# Altium schematic sheet XTXBoard(2CPU).SchDoc
size C; DocumentNumber: 6; SheetNumber: 6; SheetTotal: 8
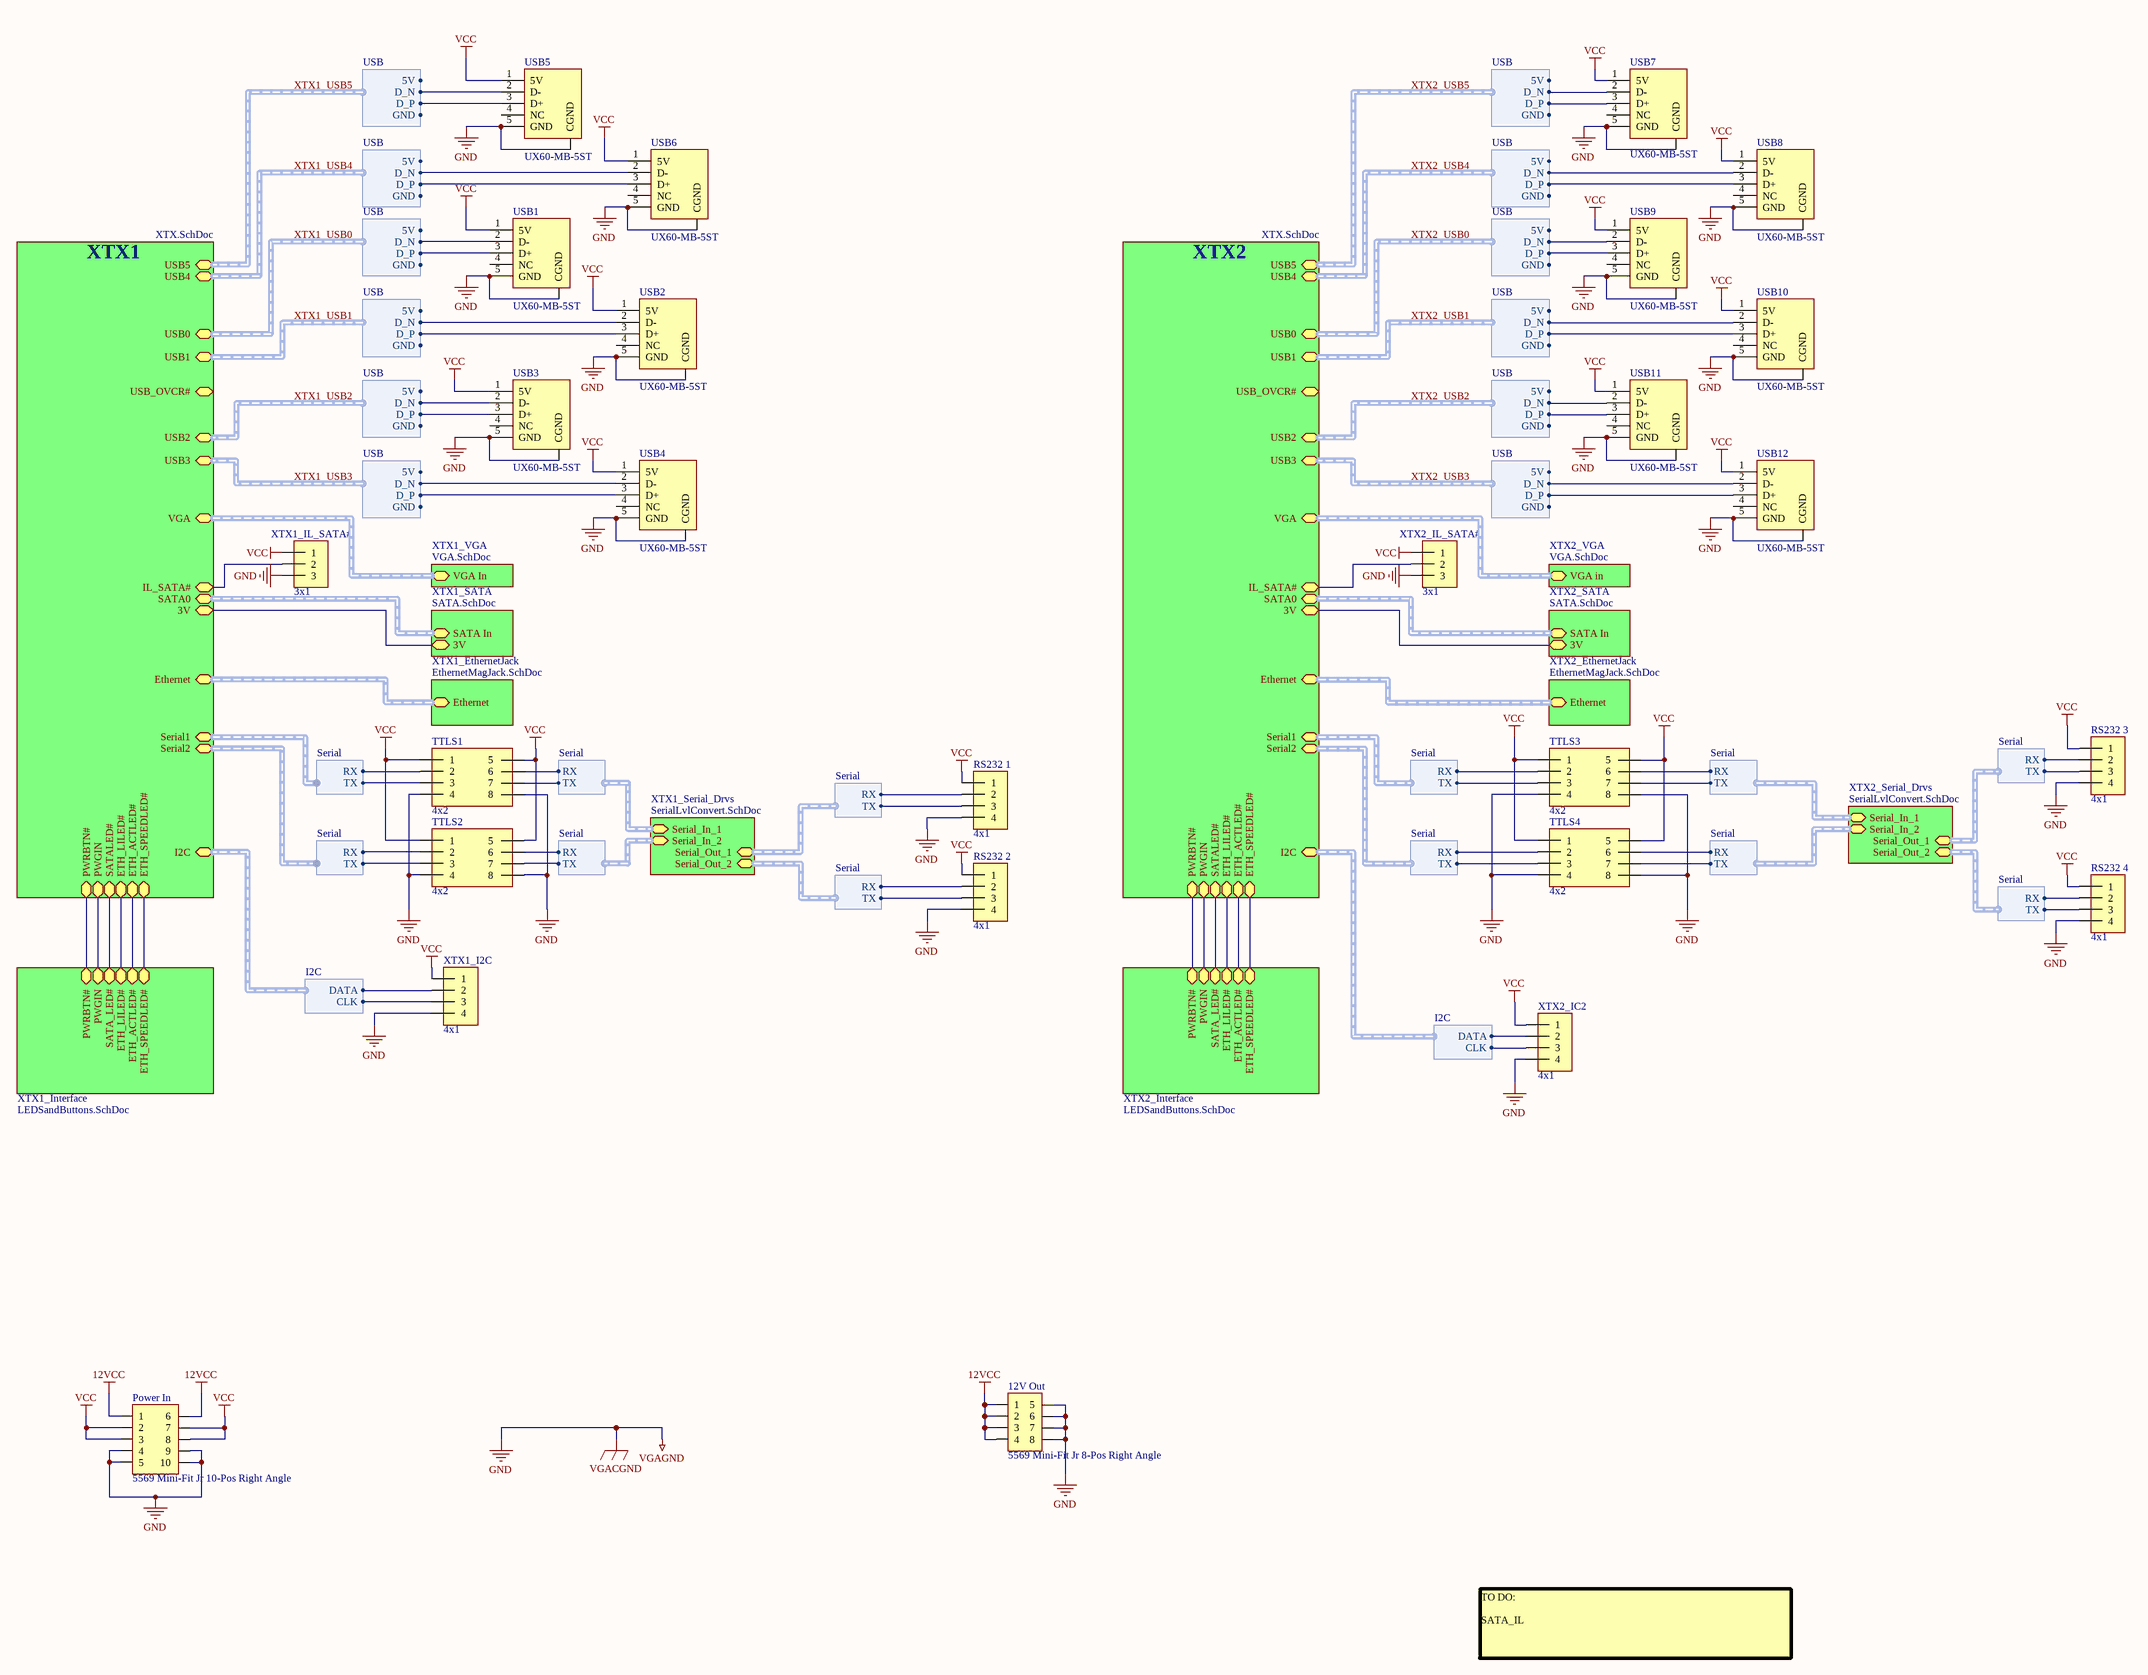
[diagram p0: XTXBoard(2CPU).SchDoc]

## Parts
12V_Out  5569 Mini-Fit Jr 8-Pos Right Angle  [8-POS 5569 Mini-Fit Jr 2]
Power_In  5569 Mini-Fit Jr 10-Pos Right Angle  [10-Pos 5569 Mini-Fit Jr 2]
RS232_1  4x1  [Male 4x1]
RS232_2  4x1  [Male 4x1]
RS232_3  4x1  [Male 4x1]
RS232_4  4x1  [Male 4x1]
TTLS1  4x2  [Male 4x2]
TTLS2  4x2  [Male 4x2]
TTLS3  4x2  [FEMALE 4x2]
TTLS4  4x2  [FEMALE 4x2]
USB1  UX60-MB-5ST  [UX60-MB-5ST]
USB2  UX60-MB-5ST  [UX60-MB-5ST]
USB3  UX60-MB-5ST  [UX60-MB-5ST]
USB4  UX60-MB-5ST  [UX60-MB-5ST]
USB5  UX60-MB-5ST  [UX60-MB-5ST]
USB6  UX60-MB-5ST  [UX60-MB-5ST]
USB7  UX60-MB-5ST  [UX60-MB-5ST]
USB8  UX60-MB-5ST  [UX60-MB-5ST]
USB9  UX60-MB-5ST  [UX60-MB-5ST]
USB10  UX60-MB-5ST  [UX60-MB-5ST]
USB11  UX60-MB-5ST  [UX60-MB-5ST]
USB12  UX60-MB-5ST  [UX60-MB-5ST]
XTX1_I2C  4x1  [Male 4x1]
XTX1_IL_SATA#  3x1  [Male 3x1]
XTX2_IC2  4x1  [Male 4x1]
XTX2_IL_SATA#  3x1  [Male 3x1]

## Sub-sheets
XTX1 = XTX.SchDoc: ETH_LILED#, ETH_ACTLED#, ETH_SPEEDLED#, Ethernet (harness Ethernet), SATA0 (harness SATA), VGA (harness VGA), USB0 (harness USB), USB2 (harness USB), USB3 (harness USB), USB1 (harness USB), USB_OVCR#, SATALED#, I2C (harness I2C), Serial1 (harness Serial), Serial2 (harness Serial), PWRBTN#, PWGIN, 3V, IL_SATA#, USB5 (harness USB), USB4 (harness USB)
XTX1_EthernetJack = EthernetMagJack.SchDoc: Ethernet (harness Ethernet)
XTX1_Interface = LEDSandButtons.SchDoc: ETH_LILED#, ETH_ACTLED#, SATA_LED#, PWRBTN#, ETH_SPEEDLED#, PWGIN
XTX1_SATA = SATA.SchDoc: SATA In (harness SATA), 3V
XTX1_Serial_Drvs = SerialLvlConvert.SchDoc: Serial_In_2 (harness Serial), Serial_In_1 (harness Serial), Serial_Out_2 (harness Serial), Serial_Out_1 (harness Serial)
XTX1_VGA = VGA.SchDoc: VGA In (harness VGA)
XTX2 = XTX.SchDoc: USB5 (harness USB), USB4 (harness USB), USB0 (harness USB), USB1 (harness USB), USB_OVCR#, USB2 (harness USB), USB3 (harness USB), VGA (harness VGA), IL_SATA#, SATA0 (harness SATA), 3V, Ethernet (harness Ethernet), Serial1 (harness Serial), Serial2 (harness Serial), I2C (harness I2C), PWRBTN#, PWGIN, ETH_LILED#, SATALED#, ETH_ACTLED#, ETH_SPEEDLED#
XTX2_EthernetJack = EthernetMagJack.SchDoc: Ethernet (harness Ethernet)
XTX2_Interface = LEDSandButtons.SchDoc: PWRBTN#, PWGIN, SATA_LED#, ETH_LILED#, ETH_ACTLED#, ETH_SPEEDLED#
XTX2_SATA = SATA.SchDoc: SATA In (harness SATA), 3V
XTX2_Serial_Drvs = SerialLvlConvert.SchDoc: Serial_In_1 (harness Serial), Serial_In_2 (harness Serial), Serial_Out_1 (harness Serial), Serial_Out_2 (harness Serial)
XTX2_VGA = VGA.SchDoc: VGA in (harness VGA)

## Harnesses
USB: 5V, D_N, D_P, GND
I2C: CLK, DATA
Serial: RX, TX

## Nets
12VCC: 12V_Out.1 12V_Out.2 12V_Out.3 12V_Out.4 Power_In.1 Power_In.6
GND: 12V_Out.5 12V_Out.6 12V_Out.7 12V_Out.8 Power_In.4 Power_In.5 Power_In.9 Power_In.10 RS232_1.4 RS232_2.4 RS232_3.4 RS232_4.4 TTLS1.4 TTLS1.8 TTLS2.4 TTLS2.8 TTLS3.4 TTLS3.8 TTLS4.4 TTLS4.8 USB1.5(GND) USB1.CGND USB2.5(GND) USB2.CGND USB3.5(GND) USB3.CGND USB4.5(GND) USB4.CGND USB5.5(GND) USB5.CGND USB6.5(GND) USB6.CGND USB7.5(GND) USB7.CGND USB8.5(GND) USB8.CGND USB9.5(GND) USB9.CGND USB10.5(GND) USB10.CGND USB11.5(GND) USB11.CGND USB12.5(GND) USB12.CGND XTX1_I2C.4 XTX1_IL_SATA#.3 XTX2_IC2.4 XTX2_IL_SATA#.3  [also labelled VGACGND, VGAGND]
VCC: Power_In.2 Power_In.3 Power_In.7 Power_In.8 RS232_1.1 RS232_2.1 RS232_3.1 RS232_4.1 TTLS1.1 TTLS1.5 TTLS2.1 TTLS2.5 TTLS3.1 TTLS3.5 TTLS4.1 TTLS4.5 USB1.1(5V) USB2.1(5V) USB3.1(5V) USB4.1(5V) USB5.1(5V) USB6.1(5V) USB7.1(5V) USB8.1(5V) USB9.1(5V) USB10.1(5V) USB11.1(5V) USB12.1(5V) XTX1_I2C.1 XTX1_IL_SATA#.1 XTX2_IC2.1 XTX2_IL_SATA#.1
XTX1_USB0.D_N: USB1.2(D-) ; sheet XTX1/USB0.D_N
XTX1_USB0.D_P: USB1.3(D+) ; sheet XTX1/USB0.D_P
XTX1_USB1.D_N: USB2.2(D-) ; sheet XTX1/USB1.D_N
XTX1_USB1.D_P: USB2.3(D+) ; sheet XTX1/USB1.D_P
XTX1_USB2.D_N: USB3.2(D-) ; sheet XTX1/USB2.D_N
XTX1_USB2.D_P: USB3.3(D+) ; sheet XTX1/USB2.D_P
XTX1_USB3.D_N: USB4.2(D-) ; sheet XTX1/USB3.D_N
XTX1_USB3.D_P: USB4.3(D+) ; sheet XTX1/USB3.D_P
XTX1_USB4.D_N: USB6.2(D-) ; sheet XTX1/USB4.D_N
XTX1_USB4.D_P: USB6.3(D+) ; sheet XTX1/USB4.D_P
XTX1_USB5.D_N: USB5.2(D-) ; sheet XTX1/USB5.D_N
XTX1_USB5.D_P: USB5.3(D+) ; sheet XTX1/USB5.D_P
XTX2_USB0.D_N: USB9.2(D-) ; sheet XTX2/USB0.D_N
XTX2_USB0.D_P: USB9.3(D+) ; sheet XTX2/USB0.D_P
XTX2_USB1.D_N: USB10.2(D-) ; sheet XTX2/USB1.D_N
XTX2_USB1.D_P: USB10.3(D+) ; sheet XTX2/USB1.D_P
XTX2_USB2.D_N: USB11.2(D-) ; sheet XTX2/USB2.D_N
XTX2_USB2.D_P: USB11.3(D+) ; sheet XTX2/USB2.D_P
XTX2_USB3.D_N: USB12.2(D-) ; sheet XTX2/USB3.D_N
XTX2_USB3.D_P: USB12.3(D+) ; sheet XTX2/USB3.D_P
XTX2_USB4.D_N: USB8.2(D-) ; sheet XTX2/USB4.D_N
XTX2_USB4.D_P: USB8.3(D+) ; sheet XTX2/USB4.D_P
XTX2_USB5.D_N: USB7.2(D-) ; sheet XTX2/USB5.D_N
XTX2_USB5.D_P: USB7.3(D+) ; sheet XTX2/USB5.D_P
NetRS232_1_2: RS232_1.2 ; sheet XTX1_Serial_Drvs/Serial_Out_1.RX
NetRS232_1_3: RS232_1.3 ; sheet XTX1_Serial_Drvs/Serial_Out_1.TX
NetRS232_2_2: RS232_2.2 ; sheet XTX1_Serial_Drvs/Serial_Out_2.RX
NetRS232_2_3: RS232_2.3 ; sheet XTX1_Serial_Drvs/Serial_Out_2.TX
NetRS232_3_2: RS232_3.2 ; sheet XTX2_Serial_Drvs/Serial_Out_1.RX
NetRS232_3_3: RS232_3.3 ; sheet XTX2_Serial_Drvs/Serial_Out_1.TX
NetRS232_4_2: RS232_4.2 ; sheet XTX2_Serial_Drvs/Serial_Out_2.RX
NetRS232_4_3: RS232_4.3 ; sheet XTX2_Serial_Drvs/Serial_Out_2.TX
NetTTLS1_2: TTLS1.2 ; sheet XTX1/Serial1.RX
NetTTLS1_3: TTLS1.3 ; sheet XTX1/Serial1.TX
NetTTLS1_6: TTLS1.6 ; sheet XTX1_Serial_Drvs/Serial_In_1.RX
NetTTLS1_7: TTLS1.7 ; sheet XTX1_Serial_Drvs/Serial_In_1.TX
NetTTLS2_2: TTLS2.2 ; sheet XTX1/Serial2.RX
NetTTLS2_3: TTLS2.3 ; sheet XTX1/Serial2.TX
NetTTLS2_6: TTLS2.6 ; sheet XTX1_Serial_Drvs/Serial_In_2.RX
NetTTLS2_7: TTLS2.7 ; sheet XTX1_Serial_Drvs/Serial_In_2.TX
NetTTLS3_2: TTLS3.2 ; sheet XTX2/Serial1.RX
NetTTLS3_3: TTLS3.3 ; sheet XTX2/Serial1.TX
NetTTLS3_6: TTLS3.6 ; sheet XTX2_Serial_Drvs/Serial_In_1.RX
NetTTLS3_7: TTLS3.7 ; sheet XTX2_Serial_Drvs/Serial_In_1.TX
NetTTLS4_2: TTLS4.2 ; sheet XTX2/Serial2.RX
NetTTLS4_3: TTLS4.3 ; sheet XTX2/Serial2.TX
NetTTLS4_6: TTLS4.6 ; sheet XTX2_Serial_Drvs/Serial_In_2.RX
NetTTLS4_7: TTLS4.7 ; sheet XTX2_Serial_Drvs/Serial_In_2.TX
NetXTX1_I2C_2: XTX1_I2C.2 ; sheet XTX1/I2C.DATA
NetXTX1_I2C_3: XTX1_I2C.3 ; sheet XTX1/I2C.CLK
NetXTX1_IL_SATA#_2: XTX1_IL_SATA#.2 ; sheet XTX1/IL_SATA#
NetXTX2_IC2_2: XTX2_IC2.2 ; sheet XTX2/I2C.DATA
NetXTX2_IC2_3: XTX2_IC2.3 ; sheet XTX2/I2C.CLK
NetXTX2_IL_SATA#_2: XTX2_IL_SATA#.2 ; sheet XTX2/IL_SATA#
(unnamed): sheet XTX1/ETH_LILED#, sheet XTX1_Interface/ETH_LILED#
(unnamed): sheet XTX1/ETH_ACTLED#, sheet XTX1_Interface/ETH_ACTLED#
(unnamed): sheet XTX1/ETH_SPEEDLED#, sheet XTX1_Interface/ETH_SPEEDLED#
(unnamed): sheet XTX1/SATALED#, sheet XTX1_Interface/SATA_LED#
(unnamed): sheet XTX1/PWRBTN#, sheet XTX1_Interface/PWRBTN#
(unnamed): sheet XTX1/PWGIN, sheet XTX1_Interface/PWGIN
(unnamed): sheet XTX1/3V, sheet XTX1_SATA/3V
(unnamed): sheet XTX2/3V, sheet XTX2_SATA/3V
(unnamed): sheet XTX2/PWRBTN#, sheet XTX2_Interface/PWRBTN#
(unnamed): sheet XTX2/PWGIN, sheet XTX2_Interface/PWGIN
(unnamed): sheet XTX2/ETH_LILED#, sheet XTX2_Interface/ETH_LILED#
(unnamed): sheet XTX2/SATALED#, sheet XTX2_Interface/SATA_LED#
(unnamed): sheet XTX2/ETH_ACTLED#, sheet XTX2_Interface/ETH_ACTLED#
(unnamed): sheet XTX2/ETH_SPEEDLED#, sheet XTX2_Interface/ETH_SPEEDLED#

Not connected (* = marked no-connect by the designer): USB1 4(NC); USB2 4(NC); USB3 4(NC); USB4 4(NC); USB5 4(NC); USB6 4(NC); USB7 4(NC); USB8 4(NC); USB9 4(NC); USB10 4(NC); USB11 4(NC); USB12 4(NC)

## Buses and harness runs
harness sheet XTX1/Ethernet = sheet XTX1_EthernetJack/Ethernet
harness sheet XTX1/SATA0 = sheet XTX1_SATA/SATA In
harness sheet XTX1/VGA = sheet XTX1_VGA/VGA In
harness sheet XTX2/Ethernet = sheet XTX2_EthernetJack/Ethernet
harness sheet XTX2/SATA0 = sheet XTX2_SATA/SATA In
harness sheet XTX2/VGA = sheet XTX2_VGA/VGA in
harness XTX1_USB0 = sheet XTX1/USB0
harness XTX1_USB1 = sheet XTX1/USB1
harness XTX1_USB2 = sheet XTX1/USB2
harness XTX1_USB3 = sheet XTX1/USB3
harness XTX1_USB4 = sheet XTX1/USB4
harness XTX1_USB5 = sheet XTX1/USB5
harness XTX2_USB0 = sheet XTX2/USB0
harness XTX2_USB1 = sheet XTX2/USB1
harness XTX2_USB2 = sheet XTX2/USB2
harness XTX2_USB3 = sheet XTX2/USB3
harness XTX2_USB4 = sheet XTX2/USB4
harness XTX2_USB5 = sheet XTX2/USB5

## Notes on the sheet
- TO DO:
  SATA_IL

## Library data of the parts
RS232_1-RS232_4 XTX1_I2C XTX2_IC2 = 4x1: 4x1 100mil Header
TTLS1-TTLS4 = 4x2: 4x2 100mil Header
USB1-USB12 = UX60-MB-5ST: miniUSB Type B SMT Connector
XTX1_IL_SATA# XTX2_IL_SATA# = 3x1: 3x1 100mil Header